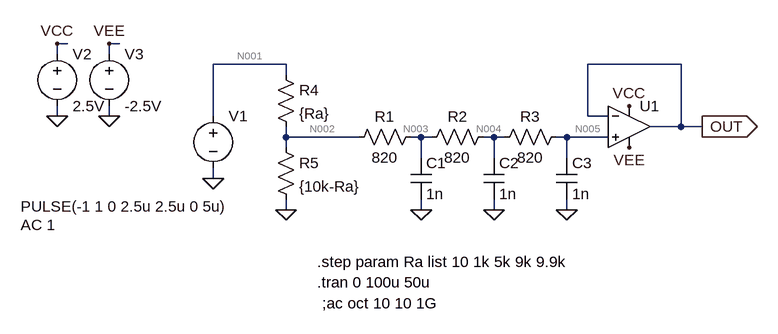
[diagram p0: schematic Triple CR with POT.asc]
Triple CR with POT.asc, the LTspice schematic file:
Version 4
SHEET 1 880 680
WIRE -352 -16 -368 -16
WIRE -272 -16 -288 -16
WIRE -368 0 -368 -16
WIRE -288 0 -288 -16
WIRE -16 16 -128 16
WIRE 592 16 448 16
WIRE -16 32 -16 16
WIRE -368 96 -368 80
WIRE -288 96 -288 80
WIRE -128 96 -128 16
WIRE 448 96 448 16
WIRE 480 96 448 96
WIRE 592 112 592 16
WIRE 592 112 544 112
WIRE 624 112 592 112
WIRE -16 128 -16 112
WIRE 96 128 -16 128
WIRE 192 128 176 128
WIRE 208 128 192 128
WIRE 304 128 288 128
WIRE 320 128 304 128
WIRE 416 128 400 128
WIRE 480 128 416 128
WIRE -16 144 -16 128
WIRE 192 160 192 128
WIRE 304 160 304 128
WIRE 416 160 416 128
WIRE -128 192 -128 176
WIRE -16 240 -16 224
WIRE 192 240 192 224
WIRE 304 240 304 224
WIRE 416 240 416 224
FLAG -16 240 0
FLAG 192 240 0
FLAG 304 240 0
FLAG 416 240 0
FLAG -128 192 0
FLAG 624 112 OUT
IOPIN 624 112 Out
FLAG -368 96 0
FLAG -288 96 0
FLAG -368 -16 VCC
FLAG -288 -16 VEE
FLAG 512 80 VCC
FLAG 512 144 VEE
SYMBOL res 192 112 R90
WINDOW 0 0 56 VBottom 2
WINDOW 3 32 56 VTop 2
SYMATTR InstName R1
SYMATTR Value 820
SYMBOL res 304 112 R90
WINDOW 0 0 56 VBottom 2
WINDOW 3 32 56 VTop 2
SYMATTR InstName R2
SYMATTR Value 820
SYMBOL res 416 112 R90
WINDOW 0 0 56 VBottom 2
WINDOW 3 32 56 VTop 2
SYMATTR InstName R3
SYMATTR Value 820
SYMBOL cap 176 160 R0
SYMATTR InstName C1
SYMATTR Value 1n
SYMBOL cap 288 160 R0
SYMATTR InstName C2
SYMATTR Value 1n
SYMBOL cap 400 160 R0
SYMATTR InstName C3
SYMATTR Value 1n
SYMBOL res -32 16 R0
SYMATTR InstName R4
SYMATTR Value {Ra}
SYMBOL res -32 128 R0
SYMATTR InstName R5
SYMATTR Value {10k-Ra}
SYMBOL voltage -128 80 R0
WINDOW 3 -296 155 Left 2
WINDOW 123 -296 183 Left 2
WINDOW 39 0 0 Left 2
SYMATTR Value PULSE(-1 1 0 2.5u 2.5u 0 5u)
SYMATTR Value2 AC 1
SYMATTR InstName V1
SYMBOL Opamps\\UniversalOpamp2 512 112 R0
SYMATTR InstName U1
SYMBOL voltage -368 -16 R0
WINDOW 123 0 0 Left 2
WINDOW 39 0 0 Left 2
SYMATTR InstName V2
SYMATTR Value 2.5V
SYMBOL voltage -288 -16 R0
WINDOW 123 0 0 Left 2
WINDOW 39 0 0 Left 2
SYMATTR InstName V3
SYMATTR Value -2.5V
TEXT 32 320 Left 2 !.step param Ra list 10 1k 5k 9k 9.9k
TEXT 32 352 Left 2 !.tran 0 100u 50u
TEXT 40 384 Left 2 !;ac oct 10 10 1G

The netlist it stands for:
* Triple CR with POT.asc
R1 N003 N002 820
R2 N004 N003 820
R3 N005 N004 820
C1 N003 0 1n
C2 N004 0 1n
C3 N005 0 1n
R4 N001 N002 {Ra}
R5 N002 0 {10k-Ra}
V1 N001 0 PULSE(-1 1 0 2.5u 2.5u 0 5u) AC 1
XU1 N005 OUT VCC VEE OUT level.2 Avol=1Meg GBW=10Meg Slew=10Meg ilimit=25m rail=0 Vos=0 phimargin=45 en=0 enk=0 in=0 ink=0 Rin=500Meg  ; pins IN+ IN- V+ V- OUT
V2 VCC 0 2.5V
V3 VEE 0 -2.5V
.step param Ra list 10 1k 5k 9k 9.9k
.tran 0 100u 50u
;ac oct 10 10 1G
.lib UniversalOpamps2.sub
.backanno
.end

* Results of the author's LTspice run, read from the files saved beside the schematic
* Operating Point (first step), zero values left out:
*   ra = 10 
*   V(n003) = -999 mV
*   V(n002) = -999 mV
*   V(n004) = -999 mV
*   V(n005) = -999 mV
*   V(n001) = -1 V
*   V(out) = -999 mV
*   V(vcc) = 2.5 V
*   V(vee) = -2.5 V
*   I(R5) = -100 µA
*   I(R4) = -100 µA
*   I(R3) = 1.998 nA
*   I(R2) = 1.998 nA
*   I(R1) = 1.998 nA
*   I(V3) = 229.2 µA
*   I(V2) = -229.2 µA
*   I(V1) = 100 µA
*   Ix(u1:1) = -1.998 nA
*   Ix(u1:2) = -1.998 nA
*   Ix(u1:3) = 229.2 µA
*   Ix(u1:4) = -229.2 µA
*   Ix(u1:5) = 1.998 nA
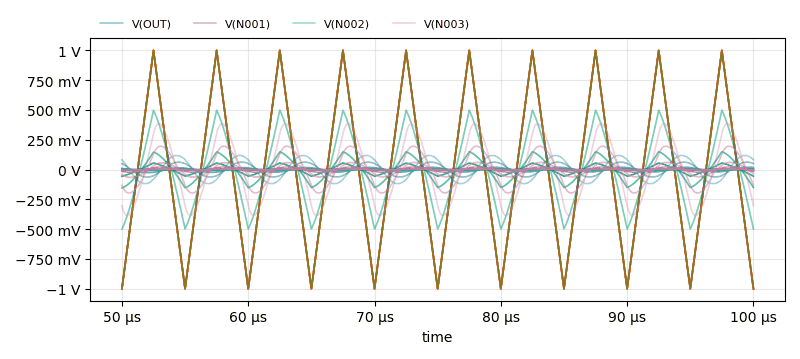
[diagram p1: Transient Analysis of Triple CR with POT.asc, plotted from the saved traces]
* Transient Analysis, 9 runs:
*   V(OUT) [run 1]: min -118.3 mV, max 118.3 mV, average -28.99 nV, rms 84.88 mV, last 81.97 mV
*   V(OUT) [run 2]: 50.05 mV at time=50 µs, 50.05 mV at time=50 µs, min 50.05 mV, max 50.05 mV
*   V(OUT) [run 3]: min -62.67 mV, max 62.23 mV, average -79.9 µV, rms 44.48 mV, last 50.65 mV
*   V(OUT) [run 4]: 10.13 mV at time=50 µs, 10.13 mV at time=50 µs, min 10.13 mV, max 10.13 mV
*   V(OUT) [run 5]: min -25.18 mV, max 19.39 mV, average -1.547 mV, rms 14.14 mV, last 16.9 mV
*   V(OUT) [run 6]: 5.561 mV at time=50 µs, 5.561 mV at time=50 µs, min 5.561 mV, max 5.561 mV
*   V(OUT) [run 7]: min -6.964 mV, max 6.915 mV, average -8.876 µV, rms 4.942 mV, last 5.627 mV
*   V(OUT) [run 8]: 790.7 µV at time=50 µs, 790.7 µV at time=50 µs, min 790.7 µV, max 790.7 µV
*   V(N001) [run 1]: min -1 V, max 1 V, average -1.221 µV, rms 578.2 mV, last -1 V
*   V(N001) [run 2]: -1 V at time=50 µs, -1 V at time=50 µs, min -1 V, max -1 V
*   V(N001) [run 3]: min -1 V, max 1 V, average 0 V, rms 578.2 mV, last -1 V
*   V(N001) [run 4]: -1 V at time=50 µs, -1 V at time=50 µs, min -1 V, max -1 V
*   V(N001) [run 5]: min -1 V, max 1 V, average 0 V, rms 578.2 mV, last -1 V
*   V(N001) [run 6]: -1 V at time=50 µs, -1 V at time=50 µs, min -1 V, max -1 V
*   V(N001) [run 7]: min -1 V, max 1 V, average 0 V, rms 578.2 mV, last -1 V
*   V(N001) [run 8]: -1 V at time=50 µs, -1 V at time=50 µs, min -1 V, max -1 V
*   V(N002) [run 1]: min -990.6 mV, max 990.6 mV, average -1.193 µV, rms 573.1 mV, last -990.6 mV
*   V(N002) [run 2]: -497.8 mV at time=50 µs, -497.8 mV at time=50 µs, min -497.8 mV, max -497.8 mV
*   V(N002) [run 3]: min -497.8 mV, max 497.6 mV, average -27.16 µV, rms 299.6 mV, last -497.6 mV
*   V(N002) [run 4]: -154.2 mV at time=50 µs, -154.2 mV at time=50 µs, min -154.2 mV, max -154.2 mV
*   V(N002) [run 5]: min -154.2 mV, max 150.1 mV, average -919.2 µV, rms 93.47 mV, last -150.2 mV
*   V(N002) [run 6]: -55.32 mV at time=50 µs, -55.32 mV at time=50 µs, min -55.32 mV, max -55.32 mV
*   V(N002) [run 7]: min -55.32 mV, max 55.29 mV, average -3.017 µV, rms 33.29 mV, last -55.29 mV
*   V(N002) [run 8]: -9.22 mV at time=50 µs, -9.22 mV at time=50 µs, min -9.22 mV, max -9.22 mV
*   V(N003) [run 1]: min -385.3 mV, max 385.3 mV, average 1.035 µV, rms 263.3 mV, last -302.6 mV
*   V(N003) [run 2]: -131.4 mV at time=50 µs, -131.4 mV at time=50 µs, min -131.4 mV, max -131.4 mV
*   V(N003) [run 3]: min -196.4 mV, max 196.3 mV, average -51.91 µV, rms 137.9 mV, last -131 mV
*   V(N003) [run 4]: -40.8 mV at time=50 µs, -40.8 mV at time=50 µs, min -40.8 mV, max -40.8 mV
*   V(N003) [run 5]: min -65.57 mV, max 60.35 mV, average -1.221 mV, rms 43.17 mV, last -35.46 mV
*   V(N003) [run 6]: -14.6 mV at time=50 µs, -14.6 mV at time=50 µs, min -14.6 mV, max -14.6 mV
*   V(N003) [run 7]: min -21.83 mV, max 21.81 mV, average -5.766 µV, rms 15.32 mV, last -14.56 mV
*   V(N003) [run 8]: -2.758 mV at time=50 µs, -2.758 mV at time=50 µs, min -2.758 mV, max -2.758 mV